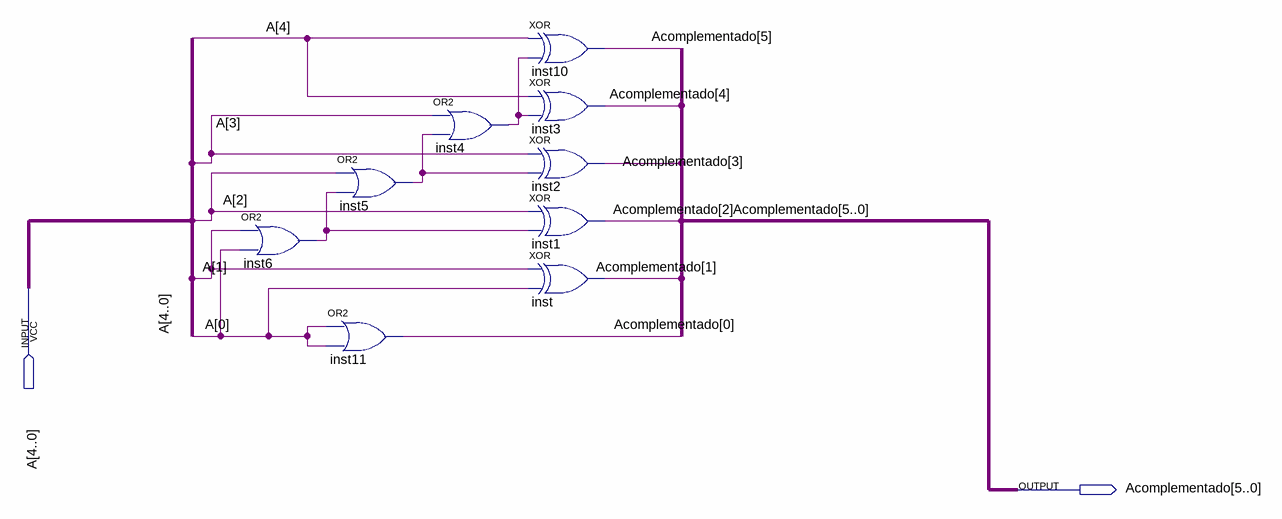
[diagram p0: schematic sheet]
// Quartus schematic mhrs_5bits_complementador2_somador.bdf as structural Verilog: 9 symbols, 2 pins
module mhrs_5bits_complementador2_somador (
  input  [4:0] A,
  output [5:0] Acomplementado
);

  wire inst4_out, inst5_out, inst6_out;

  or inst6 (inst6_out, A[1], A[0]);
  or inst5 (inst5_out, A[2], inst6_out);
  or inst11 (Acomplementado[0], A[0], A[0]);
  or inst4 (inst4_out, A[3], inst5_out);
  xor inst10 (Acomplementado[5], A[4], inst4_out);
  xor inst3 (Acomplementado[4], A[4], inst4_out);
  xor inst2 (Acomplementado[3], A[3], inst5_out);
  xor inst1 (Acomplementado[2], A[2], inst6_out);
  xor inst (Acomplementado[1], A[1], A[0]);
endmodule
